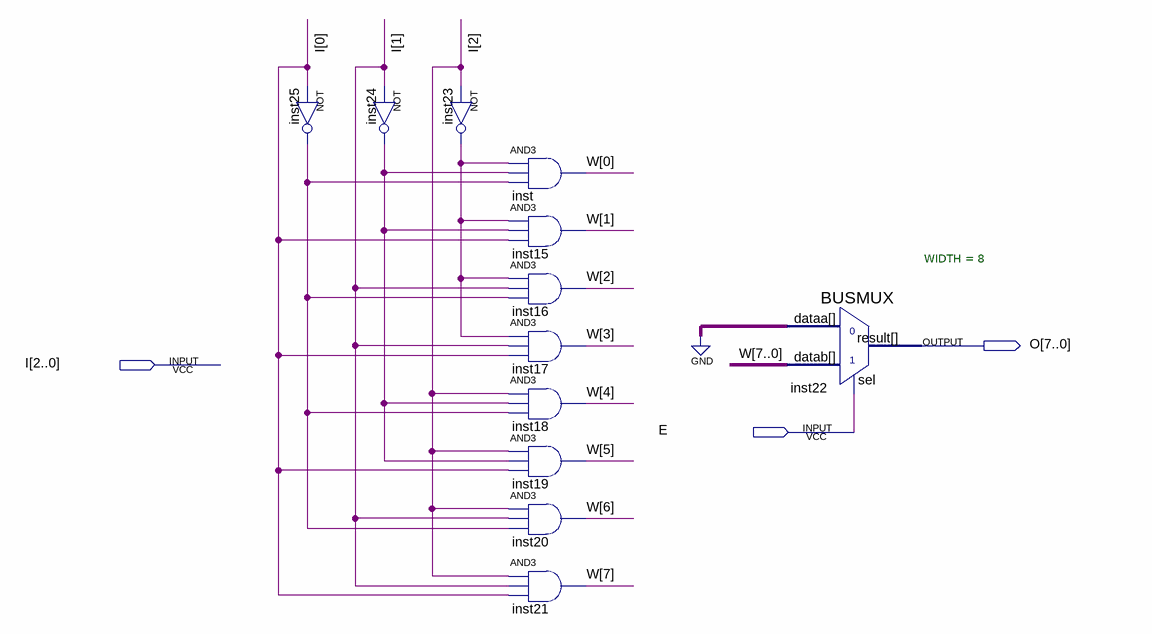
[diagram p0: schematic sheet]
// Quartus schematic Encoder3to8.bdf as structural Verilog: 12 symbols, 3 pins
module Encoder3to8 (
  input  [2:0] I,
  input  E,
  output [7:0] O
);

  wire inst23_out, inst24_out, inst25_out;
  wire [7:0] W;

  not inst25 (inst25_out, I[0]);
  not inst24 (inst24_out, I[1]);
  not inst23 (inst23_out, I[2]);
  and inst (W[0], inst23_out, inst24_out, inst25_out);
  and inst15 (W[1], inst23_out, inst24_out, I[0]);
  and inst16 (W[2], inst23_out, I[1], inst25_out);
  and inst17 (W[3], inst23_out, I[1], I[0]);
  and inst18 (W[4], I[2], inst24_out, inst25_out);
  and inst19 (W[5], I[2], inst24_out, I[0]);
  and inst20 (W[6], I[2], I[1], inst25_out);
  and inst21 (W[7], I[2], I[1], I[0]);
  BUSMUX #(.WIDTH(8)) inst22 (.datab(W), .sel(E), .dataa({8{1'b0}}), .result(O));
endmodule
